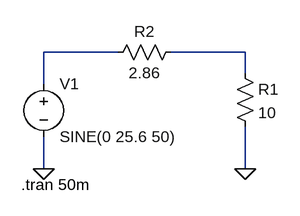
[diagram p0: schematic thevinin.transformer.asc]
thevinin.transformer.asc, the LTspice schematic file:
Version 4
SHEET 1 880 680
WIRE 112 128 0 128
WIRE 304 128 192 128
WIRE 304 160 304 128
WIRE 0 176 0 128
WIRE 0 304 0 256
WIRE 304 304 304 240
FLAG 0 304 0
FLAG 304 304 0
SYMBOL voltage 0 160 R0
WINDOW 123 0 0 Left 2
WINDOW 39 24 124 Left 2
SYMATTR InstName V1
SYMATTR Value SINE(0 25.6 50)
SYMBOL res 288 144 R0
SYMATTR InstName R1
SYMATTR Value 10
SYMBOL res 208 112 R90
WINDOW 0 0 56 VBottom 2
WINDOW 3 32 56 VTop 2
SYMATTR InstName R2
SYMATTR Value 2.86
TEXT -34 328 Left 2 !.tran 50m

The netlist it stands for:
* thevinin.transformer.asc
V1 N001 0 SINE(0 25.6 50)
R1 N002 0 10
R2 N002 N001 2.86
.tran 50m
.backanno
.end